# Altium schematic sheet split2.SchDoc
size A; SheetNumber: 3; SheetTotal: 9
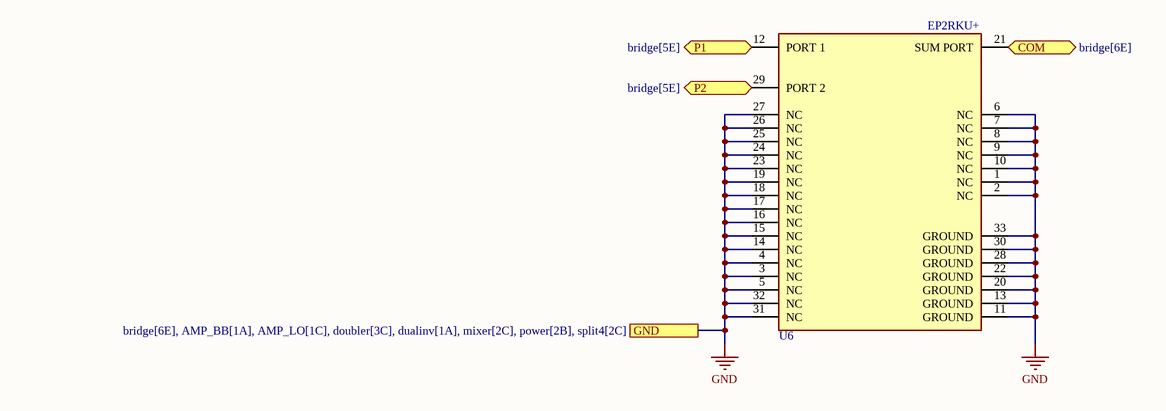
[diagram p0: split2.SchDoc]

## Parts
U6  EP2RKU+  [EP2RKU+]

## Ports
COM (bidir, see bridge[6E]), GND (see bridge[6E], AMP_BB[1A], AMP_LO[1C], doubler[3C], dualinv[1A], mixer[2C], power[2B], split4[2C]), P1 (bidir, see bridge[5E]), P2 (bidir, see bridge[5E])

## Nets
GND: U6.1(NC) U6.2(NC) U6.3(NC) U6.4(NC) U6.5(NC) U6.6(NC) U6.7(NC) U6.8(NC) U6.9(NC) U6.10(NC) U6.11(GROUND) U6.13(GROUND) U6.14(NC) U6.15(NC) U6.16(NC) U6.17(NC) U6.18(NC) U6.19(NC) U6.20(GROUND) U6.22(GROUND) U6.23(NC) U6.24(NC) U6.25(NC) U6.26(NC) U6.27(NC) U6.28(GROUND) U6.30(GROUND) U6.31(NC) U6.32(NC) U6.33(GROUND) ; port GND
COM: U6.21(SUM_PORT) ; port COM
P1: U6.12(PORT_1) ; port P1
P2: U6.29(PORT_2) ; port P2

## Library data of the parts
U6 = EP2RKU+: 2 Ways MMIC Power Splitter, DC - 18000 MHz, 50Ω; Manufacturer: Mini-Circuits; Part Number: EP2RKU+; Supplier 1: Digikey; Supplier Part Number 1: 3157-EP2RKU+CT-ND